# EAGLE design stepper_nano (EAGLE 9.6.2)
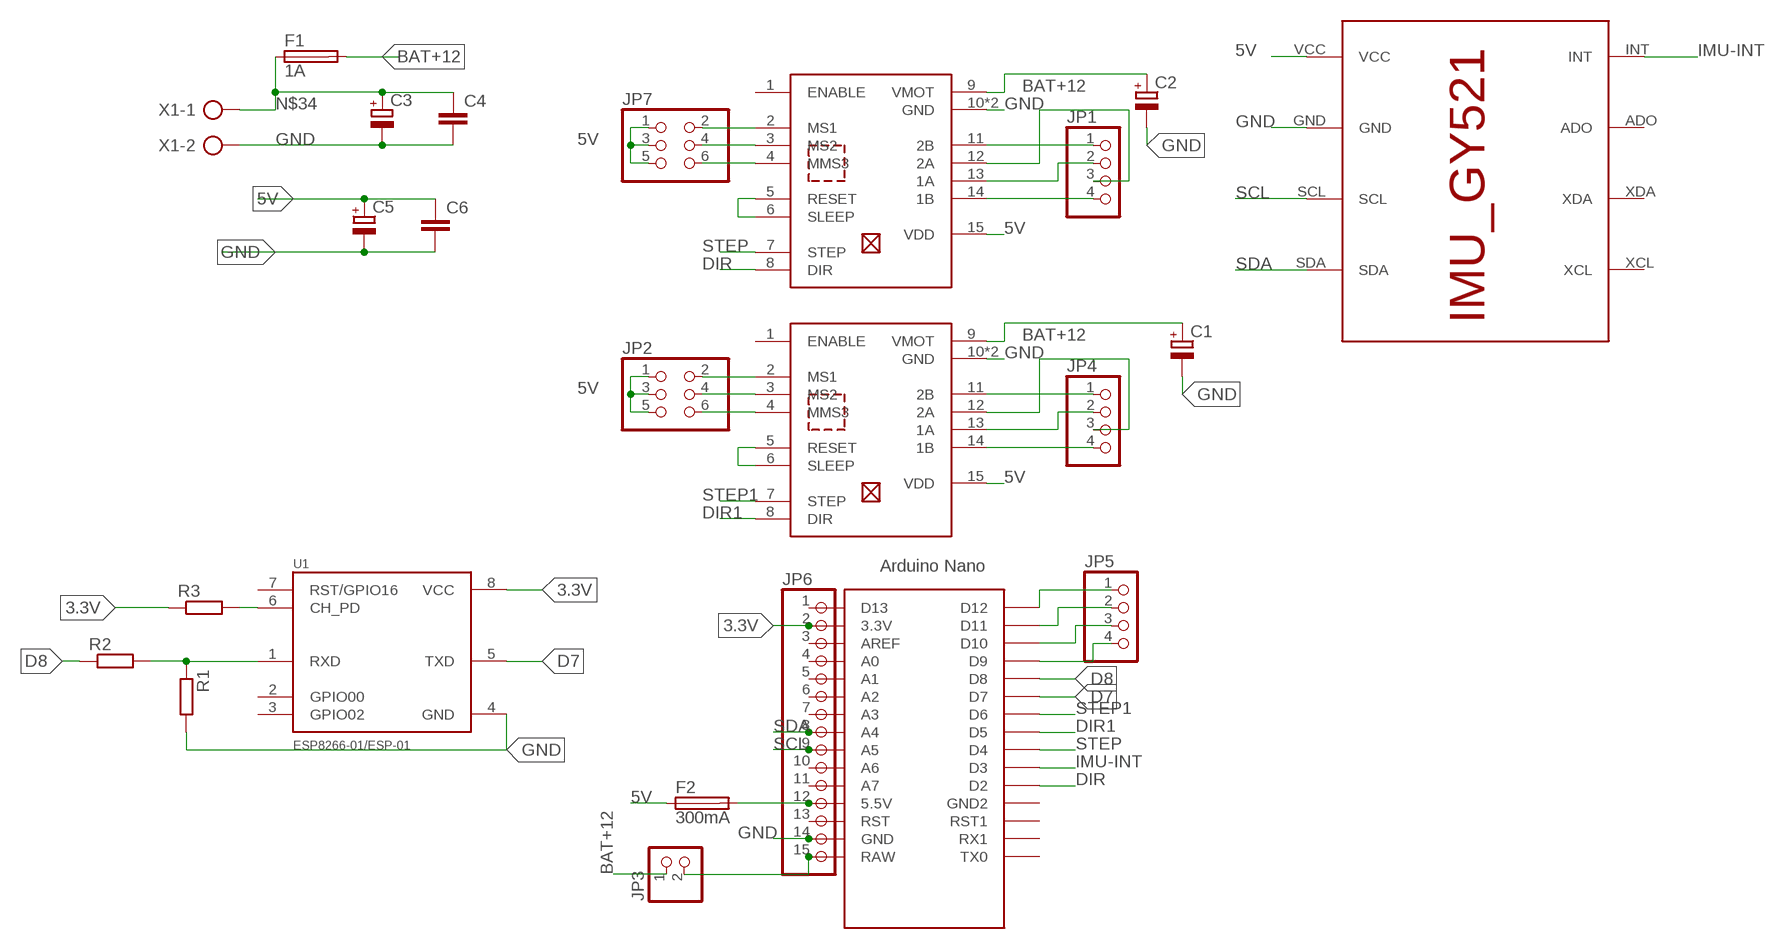
[diagram p0: schematic, sheet 1]

## Parts
C1  CPOL-EUE2-5  [E2-5]
C2  CPOL-EUE2-5  [E2-5]
C3  CPOL-EUE2-5  [E2-5]
C4  C-EU025-024X044  [C025-024X044]
C5  CPOL-EUE2-5  [E2-5]
C6  C-EU025-024X044  [C025-024X044]
F1  1A  FUSESH22  [SH22]
F2  300mA  FUSESH22  [SH22]
JP1  PINHD-1X4  [1X04]
JP2  PINHD-2X3  [2X03]
JP3  PINHD-1X2  [1X02]
JP4  PINHD-1X4  [1X04]
JP5  PINHD-1X4  [1X04]
JP6  PINHD-1X15  [1X15]
JP7  PINHD-2X3  [2X03]
R1  R-EU_0204/5  [0204/5]
R2  R-EU_0204/7  [0204/7]
R3  R-EU_0204/7  [0204/7]
U1  ESP8266-01/ESP-01  [XCVR_ESP8266-01/ESP-01]
U$1  ARDUINO_NANO  [NANO]
U$2  IMU-MPU  [IMU_GY521]
U$3  STEPPER-DRIVER  [A4988-DRIVER]
U$4  STEPPER-DRIVER  [A4988-DRIVER]
X1  AK300/2  [AK300/2]

## Nets
3.3V: JP6.2 R3.1 U1.8(VCC) U$1.3.3V
5V: C5.+ C6.1 F2.1 JP2.1 JP2.3 JP2.5 JP7.1 JP7.3 JP7.5 U$2.VCC U$3.15(VDD) U$4.15(VDD)
BAT+12: C1.+ C2.+ F1.2 JP3.1 U$3.9(VMOT) U$4.9(VMOT)
D7: U1.5(TXD) U$1.D7
D8: R2.1 U$1.D8
DIR: U$1.D2 U$3.8(DIR)
DIR1: U$1.D5 U$4.8(DIR)
FUSE-5V: F2.2 JP6.12 U$1.5V(5.5V)
GND: C1.- C2.- C3.- C4.2 C5.- C6.2 JP6.14 R1.2 U1.4(GND) U$1.GND U$2.GND U$3.10(GND) U$3.16(GND) U$4.10(GND) U$4.16(GND) X1.2
IMU-INT: U$1.D3 U$2.INT
N$1: JP1.1 U$3.11(2B)
N$2: JP1.4 U$3.14(1B)
N$3: JP1.2 U$3.13(1A)
N$4: JP1.3 U$3.12(2A)
N$5: JP4.1 U$4.11(2B)
N$6: JP4.4 U$4.14(1B)
N$7: JP4.2 U$4.13(1A)
N$8: JP4.3 U$4.12(2A)
N$9: JP7.2 U$3.2(MS1)
N$10: JP7.4 U$3.3(MS2)
N$11: JP7.6 U$3.4(MMS3)
N$12: U$3.5(RESET) U$3.6(SLEEP)
N$13: JP2.2 U$4.2(MS1)
N$14: JP2.4 U$4.3(MS2)
N$15: JP2.6 U$4.4(MMS3)
N$16: U$4.5(RESET) U$4.6(SLEEP)
N$17: R3.2 U1.6(CH_PD)
N$18: JP3.2 JP6.15 U$1.RAW
N$19: JP5.4 U$1.D9
N$20: JP5.3 U$1.D10
N$21: R1.1 R2.2 U1.1(RXD)
N$22: JP5.2 U$1.D11
N$23: JP5.1 U$1.D12
N$24: JP6.1 U$1.D13
N$25: JP6.3 U$1.AREF
N$26: JP6.4 U$1.A0
N$27: JP6.5 U$1.A1
N$28: JP6.6 U$1.A2
N$29: JP6.7 U$1.A3
N$30: JP6.10 U$1.A6
N$31: JP6.11 U$1.A7
N$32: JP6.13 U$1.RST
N$34: C3.+ C4.1 F1.1 X1.1
SCL: JP6.9 U$1.A5 U$2.SCL
SDA: JP6.8 U$1.A4 U$2.SDA
STEP: U$1.D4 U$3.7(STEP)
STEP1: U$1.D6 U$4.7(STEP)
Unconnected: U1.2(GPIO00) U1.3(GPIO02) U1.7(RST/GPIO16) U$1.GND1(GND2) U$1.RST1 U$1.RX1 U$1.TX0 U$2.ADO U$2.XCL U$2.XDA U$3.1(ENABLE) U$4.1(ENABLE)

## Library data of the parts
C1-C3 C5 = rcl:CPOL-EU: POLARIZED CAPACITOR, European symbol; SPICEPREFIX: C
C4 C6 = rcl:C-EU: CAPACITOR, European symbol; SPICEPREFIX: C
F1 F2 = fuse:FUSE: Fuse; OC_FARNELL: unknown; OC_NEWARK: unknown
JP1 JP4 JP5 = pinhead:PINHD-1X4: PIN HEADER
JP2 JP7 = pinhead:PINHD-2X3: PIN HEADER
JP3 = pinhead:PINHD-1X2: PIN HEADER
JP6 = pinhead:PINHD-1X15: PIN HEADER
R1-R3 = rcl:R-EU_: RESISTOR, European symbol; SPICEPREFIX: R
U1 = mohamed-eagle:ESP8266-01/ESP-01: ESP-01 wifi module Check prices <https://pricing.snapeda.com/parts/ESP8266-01/ESP-01/AI-Thinker/view-part?ref=eda>; AVAILABILITY: Not in stock; DESCRIPTION: MakerFocus 4pcs ESP8266 ESP-01 Serial Wireless WiFi Transceiver Receiver Module 1MB SPI Flash DC3.0-3.6V Internet of Things WiFi Module Board Compatible with Ar duino; MF: AI-Thinker; MP: ESP8266-01/ESP-01; PACKAGE: Non-Standard AI-Thinker; PRICE: None
U$1 = mohamed-eagle:ARDUINO_NANO: Arduino Nano
U$2 = mohamed-eagle:IMU-MPU
U$3 U$4 = mohamed-eagle:STEPPER-DRIVER
X1 = con-ptr500:AK300/2: CONNECTOR; OC_FARNELL: unknown; OC_NEWARK: unknown

## Board
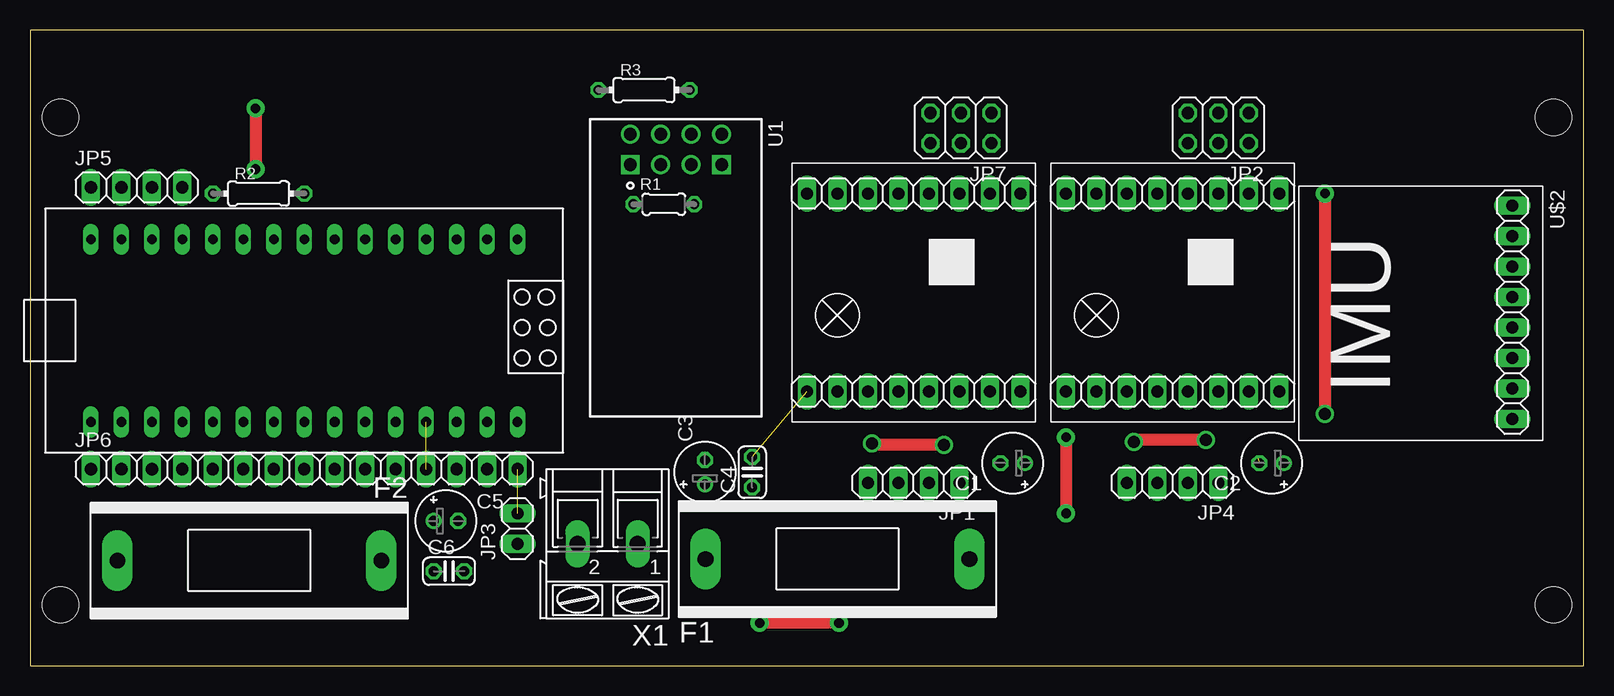
[diagram p1: board, top side]
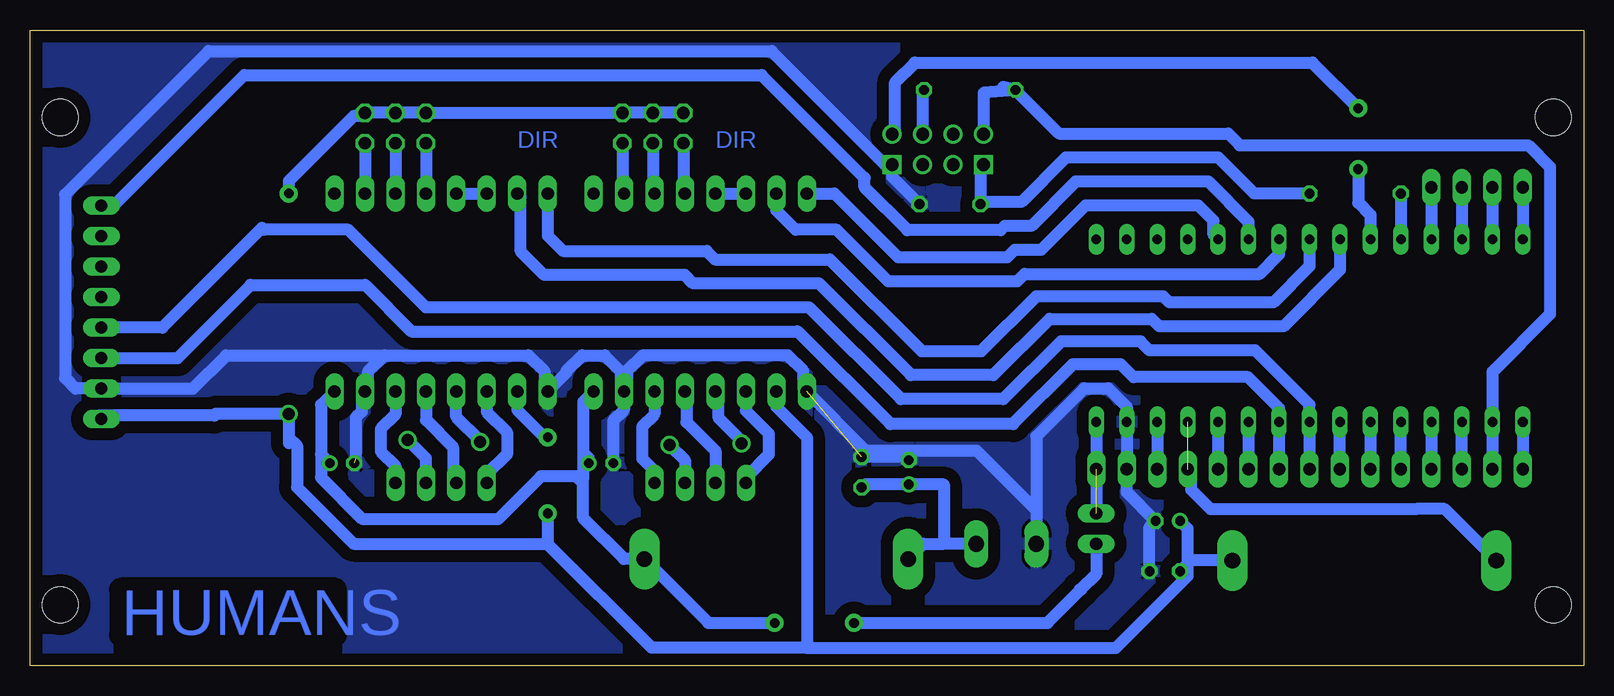
[diagram p2: board, bottom side, seen from below]

Size 129.52 x 53.01 mm. Coordinates in mm from the lower left corner, seen from the top.
Outline: 0,0 129.52,0 129.52,53.01 0,53.01 0,0
Copper layers (1*16): Top 0.035mm / dielectric 1.5mm / Bottom 0.035mm
Design rules "default *": minimum track width 6mil, minimum drill 0.35mm, track to track 1mm, track to pad 1mm, pad to pad 1mm, via to via 6mil, smd to smd 6mil, copper to edge 40mil, drill to drill 6mil, minimum pad ring 10mil, minimum via ring 8mil, stop-mask expansion 4mil, vias tented up to drill 0mil, thermal gap 10mil
Holes 3 mm at 2.54,45.72 2.54,5.08 127,5.08 127,45.72

### Footprints (pad centres in the part's own frame; a part is rotated, then mirrored left to right if it is on the bottom)
E2-5 = drill 0.813 pad 1.27: + -1.016,0 | drill 0.813 pad 1.27 octagon: - 1.016,0
C025-024X044 = drill 0.813 octagon: 1 -1.27,0; 2 1.27,0
SH22 = drill 1.321 pad 2.54 long: 1 -10.998,0; 2 10.998,0
1X04 = drill 1.016 long: 1 -3.81,0; 2 -1.27,0; 3 1.27,0; 4 3.81,0
2X03 = drill 1.016 octagon: 1 -2.54,-1.27; 2 -2.54,1.27; 3 0,-1.27; 4 0,1.27; 5 2.54,-1.27; 6 2.54,1.27
1X02 = drill 1.016 long: 1 -1.27,0; 2 1.27,0
1X15 = drill 1.016 long: 1 -17.78,0; 2 -15.24,0; 3 -12.7,0; 4 -10.16,0; 5 -7.62,0; 6 -5.08,0; 7 -2.54,0; 8 0,0; 9 2.54,0; 10 5.08,0; 11 7.62,0; 12 10.16,0; 13 12.7,0; 14 15.24,0; 15 17.78,0
0204/5 = drill 0.813 octagon: 1 -2.54,0; 2 2.54,0
0204/7 = drill 0.813 octagon: 1 -3.81,0; 2 3.81,0
XCVR_ESP8266-01/ESP-01 = drill 1.05 square: 1 0,-3.81; 4 0,3.81 | drill 1.05: 2 0,-1.27; 3 0,1.27; 5 -2.54,3.81; 6 -2.54,1.27; 7 -2.54,-1.27; 8 -2.54,-3.81
NANO = drill 0.8 long: 3.3V -10.16,24.13; 5V -10.16,-1.27; A0 -10.16,19.05; A1 -10.16,16.51; A2 -10.16,13.97; A3 -10.16,11.43; A4 -10.16,8.89; A5 -10.16,6.35; A6 -10.16,3.81; A7 -10.16,1.27; AREF -10.16,21.59; D2 5.08,1.27; D3 5.08,3.81; D4 5.08,6.35; D5 5.08,8.89; D6 5.08,11.43; D7 5.08,13.97; D8 5.08,16.51; D9 5.08,19.05; D10 5.08,21.59; D11 5.08,24.13; D12 5.08,26.67; D13 -10.16,26.67; GND -10.16,-6.35; GND1 5.08,-1.27; RAW -10.16,-8.89; RST -10.16,-3.81; RST1 5.08,-3.81; RX1 5.08,-6.35; TX0 5.08,-8.89
IMU_GY521 = drill 1.016 long: ADO -6.35,0; GND 6.35,0; INT -8.89,0; SCL 3.81,0; SDA 1.27,0; VCC 8.89,0; XCL -3.81,0; XDA -1.27,0
A4988-DRIVER = drill 1.016 long: 1 -7.62,8.89; 2 -7.62,6.35; 3 -7.62,3.81; 4 -7.62,1.27; 5 -7.62,-1.27; 6 -7.62,-3.81; 7 -7.62,-6.35; 8 -7.62,-8.89; 9 8.89,8.89; 10 8.89,6.35; 11 8.89,3.81; 12 8.89,1.27; 13 8.89,-1.27; 14 8.89,-3.81; 15 8.89,-6.35; 16 8.89,-8.89
AK300/2 = drill 1.321 long: 1 -2.515,0; 2 2.489,0

### Placement (x,y rotation side)
C1  81.92,16.89 180 top
C2  103.5,16.89 180 top
C3  56.26,16.13 90 top
C4  60.2,16.13 90 top
C5  34.67,12.07 0 top
C6  34.92,7.87 0 top
F1  67.31,8.89 0 top
F2  18.29,8.76 180 top
JP1  73.66,15.24 180 top
JP2  99.06,44.83 180 top
JP3  40.64,11.43 90 top
JP4  95.25,15.24 180 top
JP5  8.89,39.88 0 top
JP6  22.86,16.38 0 top
JP7  77.6,44.83 180 top
R1  52.83,38.48 0 top
R2  19.05,39.37 0 top
R3  51.18,48.01 0 top
U1  53.85,41.78 270 top
U$1  31.75,30.48 90 top
U$2  123.57,29.46 270 top
U$3  73.66,31.75 270 top
U$4  95.25,31.75 270 top
X1  48.13,10.16 180 top

### Tracks (layer width: path | path; a pad name or v marks a point on that pad's centre or on a via)
3.3V
  Bottom 1: R3.1 50.04,47.76 U1.8 | R3.1 48.39,48.26 | 7.62,24.13 U$1.3.3V | U$1.3.3V JP6.2 | R3.1 43.73,44.37 29.64,44.37 28.68,43.4 4.64,43.4 2.82,41.58 2.82,29.31 7.62,24.51 U$1.3.3V
5V  (via drill 0.8 pad 1.5, 1)
  Top 1: v86.36,19.05 v86.36,12.7 | v107.95,39.37 v107.95,20.99
  Bottom 1: 33.02,7.62 33.02,11.43 C5.+ | 33.02,7.62 33.02,7.46 39.04,1.45 64.77,1.45 64.77,1.52 | JP7.5 JP7.3 JP7.1 JP2.5 JP2.3 JP2.1 101.88,45.82 102.54,45.82 107.95,40.41 v107.95,39.37 | U$4.15 88.9,21.34 86.61,19.05 v86.36,19.05 | v86.36,12.7 86.36,10.16 | U$2.VCC 123.85,20.85 114.16,20.85 114.02,20.99 v107.95,20.99 107.95,19.05 | 107.95,19.05 107.95,18.54 | 33.02,7.62 33.4,7.62 C6.1 32.77,8.76 F2.1 | U$3.15 67.31,21.59 64.77,19.05 64.77,1.52 | 107.95,19.05 107.26,18.36 107.26,14.87 102.55,10.16 86.36,10.16 | 86.36,10.16 77.72,1.52 64.77,1.52
BAT+12  (via drill 0.8 pad 1.5)
  Top 1: v67.44,3.56 v60.83,3.56
  Bottom 1: 41.91,6.35 42.04,6.35 | 103.86,23.14 U$4.9 105.26,21.74 105.26,17.63 | U$3.9 83.42,22 83.42,17.78 | 105.26,17.63 105.26,15.7 101.78,12.22 90.5,12.22 86.92,15.8 84.02,15.8 83.64,15.42 83.42,15.65 | C2.+ 105.26,17.63 | 83.42,17.78 83.42,15.65 | C1.+ 82.93,17.3 83.42,17.78 | 83.42,15.65 83.42,12.3 80.01,8.89 F1.2 72.97,3.56 v67.44,3.56 | v60.83,3.56 44.7,3.56 41.91,6.35 | JP3.1 40.64,7.62 41.91,6.35
D7  (via drill 0.8 pad 1.5)
  Top 1: v18.8,46.48 v18.8,41.4
  Bottom 1: U$1.D7 17.78,37.59 18.8,38.6 v18.8,41.4 | U1.5 57.41,44.57 57.41,48.65 55.76,50.29 22.61,50.29 v18.8,46.48
D8
  Bottom 1: R2.1 15.24,38.1 U$1.D8
DIR
  Bottom 1: U$1.D2 30.87,35.95 30.87,37.11 32.13,38.37 41.53,38.37 45.23,34.67 47.44,34.67 48.08,34.04 57.14,34.04 62.47,39.37 U$3.8
DIR1
  Bottom 1: U$1.D5 22.86,33.3 25.88,30.29 34.54,30.29 35.05,30.8 45.66,30.8 50.23,26.23 55.18,26.23 62.84,33.88 72.43,33.88 73.12,34.58 85.09,34.58 86.36,35.84 U$4.8
FUSE-5V  (1 unrouted)
  Bottom 1: JP6.12 32.74,16.11 32.74,14.68 31.11,13.06 13.97,13.06 11.58,13.06 F2.2
GND  (2 unrouted)
  Bottom 1: 100,25.88 101.32,24.56 101.32,23.14 U$4.10 101.86,22.6 101.86,21.18 102.36,20.68 102.36,17.27 | 100,25.88 87.96,25.88 86.64,24.56 86.64,23.14 U$4.16 84.81,24.41 84.81,24.56 83.49,25.88 81.61,25.88 80.27,24.54 80.27,23.12 | 80.27,23.12 U$3.10 80.01,21.34 80.9,20.45 C1.- | 100,25.88 113.18,25.88 115.95,23.11 U$2.GND 125.73,23.11 126.59,23.98 126.59,39.29 114.63,51.25 67.7,51.25 58.23,41.78 U1.4 57.66,40.77 R1.2 | 80.27,23.12 79.73,23.66 79.73,24.56 78.41,25.88 66.37,25.88 65.05,24.56 65.05,23.14 U$3.16 59.82,17.91 50.6,17.91 45.64,12.95 X1.2 | X1.2 45.64,19.13 41.64,23.13 39.64,23.13 38.1,21.59 U$1.GND JP6.14 38.1,14.48 C5.- 36.2,11.56 C6.2 | X1.2 45.64,10.94 | C3.- 56.52,17.4 C4.2
  pour Bottom: 0,53.34 129.54,53.34 129.54,0 0,0
IMU-INT
  Bottom 1: 123.29,38.08 U$2.INT 122.56,38.35 111.66,49.25 68.53,49.25 59.94,40.66 59.95,40.65 59.95,39.87 56.39,36.32 48.62,36.32 48.27,36.67 46.06,36.67 42.36,40.37 31.3,40.37 27.94,37.01 U$1.D3
N$1
  Bottom 1: U$3.11 77.47,20.95 78.49,19.94 78.49,17.27 77.47,16.26 JP1.1
N$2
  Bottom 1: JP1.4 69.85,15.7 67.94,17.61 67.94,19.35 69.85,21.25 U$3.14
N$3  (via drill 1)
  Top 1: v76.2,18.41 70.32,18.41 v70.19,18.54
  Bottom 1: v76.2,18.41 74.93,17.15 JP1.2 | v70.19,18.54 70.19,18.74 72.11,20.65 72.11,22.58 U$3.13
N$4
  Bottom 1: U$3.12 74.8,22.73 74.8,20.32 72.39,17.91 JP1.3
N$5
  Bottom 1: U$4.11 99.06,20.96 100.29,19.74 100.29,17.87 99.06,16.65 JP4.1
N$6
  Bottom 1: JP4.4 91.44,15.93 89.76,17.61 89.76,19.47 91.44,21.16 U$4.14
N$7  (via drill 1)
  Top 1: v98.04,18.8 92.14,18.8 v92.01,18.67
  Bottom 1: JP4.2 96.52,17.29 v98.04,18.8 | v92.01,18.67 92.01,18.79 93.98,20.76 U$4.13
N$8
  Bottom 1: JP4.3 94.26,15.52 94.26,18.21 96.52,20.47 U$4.12
N$9
  Bottom 1: JP7.2 80.14,39.5 U$3.2
N$10
  Bottom 1: JP7.4 77.6,39.5 U$3.3
N$11
  Bottom 1: JP7.6 75.06,39.5 U$3.4
N$12
  Bottom 1: U$3.5 U$3.6
N$13
  Bottom 1: JP2.2 U$4.2
N$14
  Bottom 1: JP2.4 U$4.3
N$15
  Bottom 1: JP2.6 U$4.4
N$16
  Bottom 1: U$4.5 U$4.6
N$17
  Bottom 1: R3.2 55.12,47.99 U1.6
N$18  (1 unrouted)
  Bottom 1: U$1.RAW JP3.2
N$19
  Bottom 1: JP5.4 U$1.D9
N$20
  Bottom 1: JP5.3 U$1.D10
N$21
  Bottom 1: U1.1 50.29,41.78 R1.1 50.1,38.67 46.89,38.67 43.19,42.37 30.47,42.37 27.47,39.37 R2.2
N$22
  Bottom 1: JP5.2 U$1.D11
N$23
  Bottom 1: JP5.1 U$1.D12
N$24
  Bottom 1: U$1.D13 JP6.1
N$25
  Bottom 1: JP6.3 U$1.AREF
N$26
  Bottom 1: U$1.A0 JP6.4
N$27
  Bottom 1: JP6.5 U$1.A1
N$28
  Bottom 1: U$1.A2 JP6.6
N$29
  Bottom 1: JP6.7 U$1.A3
N$30
  Bottom 1: U$1.A6 JP6.10
N$31
  Bottom 1: U$1.A7 JP6.11
N$32
  Bottom 1: U$1.RST JP6.13
N$34
  Bottom 1: X1.1 53.34,10.16 | F1.1 55.04,10.16 53.34,10.16 | C4.1 59.94,15.11 C3.+ 53.34,15.11 53.34,10.16
SCL
  Bottom 1: U$2.SCL 117.22,25.65 111.12,31.75 101.6,31.75 97.73,27.88 65.55,27.88 57.81,20.15 47.58,20.15 42.6,25.13 38.6,25.13 37.54,24.07 27.99,24.07 25.41,21.48 U$1.A5 JP6.9
SDA
  Bottom 1: JP6.8 U$1.A4 22.86,21.77 27.38,26.29 36.2,26.29 36.96,27.05 43.56,27.05 48.39,22.23 56.93,22.23 64.59,29.88 96.52,29.88 102.98,36.35 110.01,36.35 110.17,36.51 118.49,28.19 U$2.SDA
STEP
  Bottom 1: 67.18,39.24 U$3.7 67.31,37.95 65.71,36.35 62.28,36.35 57.97,32.04 47.25,32.04 46.61,32.67 27.02,32.67 25.4,34.29 U$1.D4
STEP1
  Bottom 1: U$1.D6 20.32,33.02 25.05,28.29 35.37,28.29 36,28.92 44.52,28.92 49.22,24.23 56.1,24.23 63.76,31.88 74.24,31.88 74.93,32.58 86.65,32.58 88.62,34.55 88.62,39.09 U$4.7

### Text on the board
Bottom: DIR | DIR | HUMANS